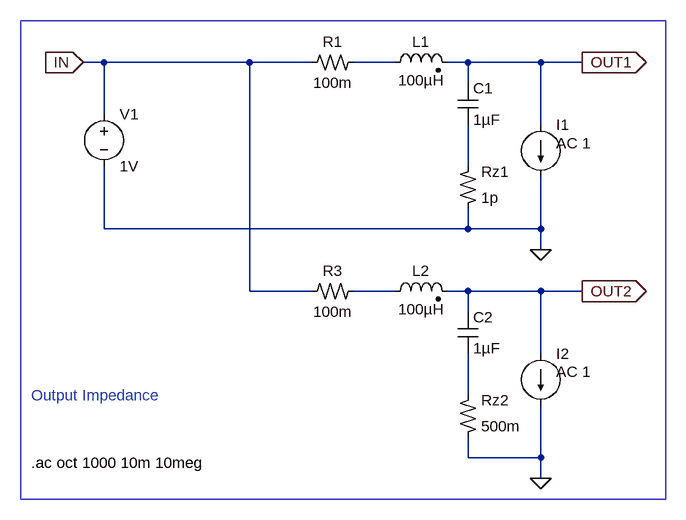
[diagram p0: schematic Switch-Mode_Power_Supplies_-_Basso-_Figure_1-56.asc]
Switch-Mode_Power_Supplies_-_Basso-_Figure_1-56.asc, the LTspice schematic file:
Version 4
SHEET 1 880 1052
WIRE -1888 -832 -1920 -832
WIRE -1664 -832 -1888 -832
WIRE -1568 -832 -1664 -832
WIRE -1440 -832 -1504 -832
WIRE -1328 -832 -1360 -832
WIRE -1216 -832 -1328 -832
WIRE -1152 -832 -1216 -832
WIRE -1328 -800 -1328 -832
WIRE -1888 -752 -1888 -832
WIRE -1216 -736 -1216 -832
WIRE -1328 -672 -1328 -736
WIRE -1888 -576 -1888 -672
WIRE -1328 -576 -1328 -608
WIRE -1328 -576 -1888 -576
WIRE -1216 -576 -1216 -656
WIRE -1216 -576 -1328 -576
WIRE -1216 -544 -1216 -576
WIRE -1664 -480 -1664 -832
WIRE -1568 -480 -1664 -480
WIRE -1440 -480 -1504 -480
WIRE -1328 -480 -1360 -480
WIRE -1216 -480 -1328 -480
WIRE -1152 -480 -1216 -480
WIRE -1328 -448 -1328 -480
WIRE -1216 -384 -1216 -480
WIRE -1328 -320 -1328 -384
WIRE -1328 -224 -1328 -256
WIRE -1216 -224 -1216 -304
WIRE -1216 -224 -1328 -224
WIRE -1216 -192 -1216 -224
FLAG -1216 -544 0
FLAG -1152 -832 OUT1
IOPIN -1152 -832 Out
FLAG -1920 -832 IN
IOPIN -1920 -832 In
FLAG -1216 -192 0
FLAG -1152 -480 OUT2
IOPIN -1152 -480 Out
SYMBOL ind2 -1456 -816 R270
WINDOW 0 32 56 VTop 0
WINDOW 3 4 56 VBottom 0
SYMATTR InstName L1
SYMATTR Value 100µH
SYMBOL cap -1344 -800 R0
SYMATTR InstName C1
SYMATTR Value 1µF
SYMBOL res2 -1504 -848 R90
WINDOW 0 0 32 VBottom 0
WINDOW 3 32 32 VTop 0
SYMATTR InstName R1
SYMATTR Value 100m
SYMBOL res2 -1344 -608 M180
WINDOW 0 36 56 Left 0
WINDOW 3 36 16 Left 0
SYMATTR InstName Rz1
SYMATTR Value 1p
SYMBOL current -1216 -736 R0
WINDOW 123 24 28 Left 0
WINDOW 39 0 0 Left 0
SYMATTR InstName I1
SYMATTR Value ""
SYMATTR Value2 AC 1
SYMBOL voltage -1888 -768 R0
WINDOW 123 0 0 Left 0
WINDOW 39 0 0 Left 0
SYMATTR InstName V1
SYMATTR Value 1V
SYMBOL ind2 -1456 -464 R270
WINDOW 0 32 56 VTop 0
WINDOW 3 4 56 VBottom 0
SYMATTR InstName L2
SYMATTR Value 100µH
SYMBOL cap -1344 -448 R0
SYMATTR InstName C2
SYMATTR Value 1µF
SYMBOL res2 -1504 -496 R90
WINDOW 0 0 32 VBottom 0
WINDOW 3 32 32 VTop 0
SYMATTR InstName R3
SYMATTR Value 100m
SYMBOL res2 -1344 -256 M180
WINDOW 0 36 56 Left 0
WINDOW 3 36 16 Left 0
SYMATTR InstName Rz2
SYMATTR Value 500m
SYMBOL current -1216 -384 R0
WINDOW 123 24 28 Left 0
WINDOW 39 0 0 Left 0
SYMATTR InstName I2
SYMATTR Value ""
SYMATTR Value2 AC 1
TEXT -2000 -216 Left 0 !.ac oct 1000 10m 10meg
TEXT -2000 -320 Left 0 ;Output Impedance
RECTANGLE Normal -2016 -896 -1024 -160

The netlist it stands for:
* Switch-Mode_Power_Supplies_-_Basso-_Figure_1-56.asc
L1 N001 OUT1 100µH
C1 OUT1 N002 1µF
R1 N001 IN 100m
Rz1 0 N002 1p
I1 OUT1 0 AC 1
V1 IN 0 1V
L2 N003 OUT2 100µH
C2 OUT2 N004 1µF
R3 N003 IN 100m
Rz2 0 N004 500m
I2 OUT2 0 AC 1
.ac oct 1000 10m 10meg
* Output Impedance
.backanno
.end